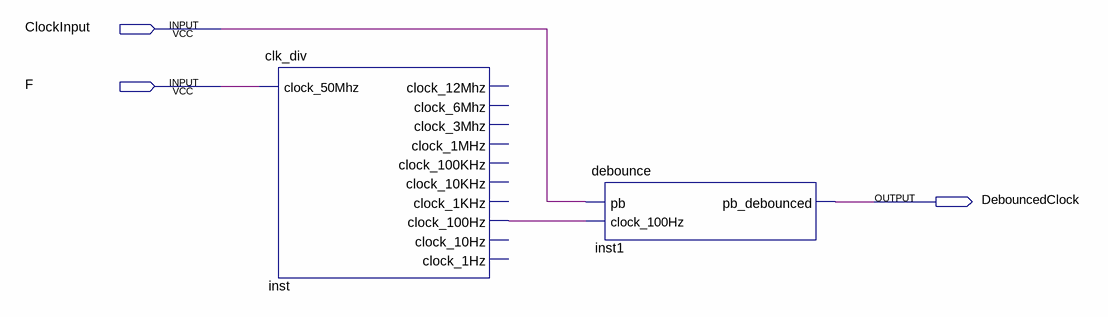
[diagram p0: schematic sheet]
// Quartus schematic Debouncer.bdf as structural Verilog: 2 symbols, 3 pins
module Debouncer (
  input  ClockInput,
  input  F,
  output DebouncedClock
);

  wire inst_clock_100hz;

  clk_div inst (
    .clock_50Mhz(F), .clock_100Hz(inst_clock_100hz));  // open: clock_12Mhz, clock_6Mhz, clock_3Mhz, clock_1MHz, clock_100KHz, clock_10KHz, clock_1KHz, clock_10Hz, clock_1Hz
  debounce inst1 (.pb(ClockInput), .clock_100Hz(inst_clock_100hz), .pb_debounced(DebouncedClock));
endmodule
